# Altium schematic sheet Alimentacion.SchDoc
size A4; SheetNumber: 6; SheetTotal: 6
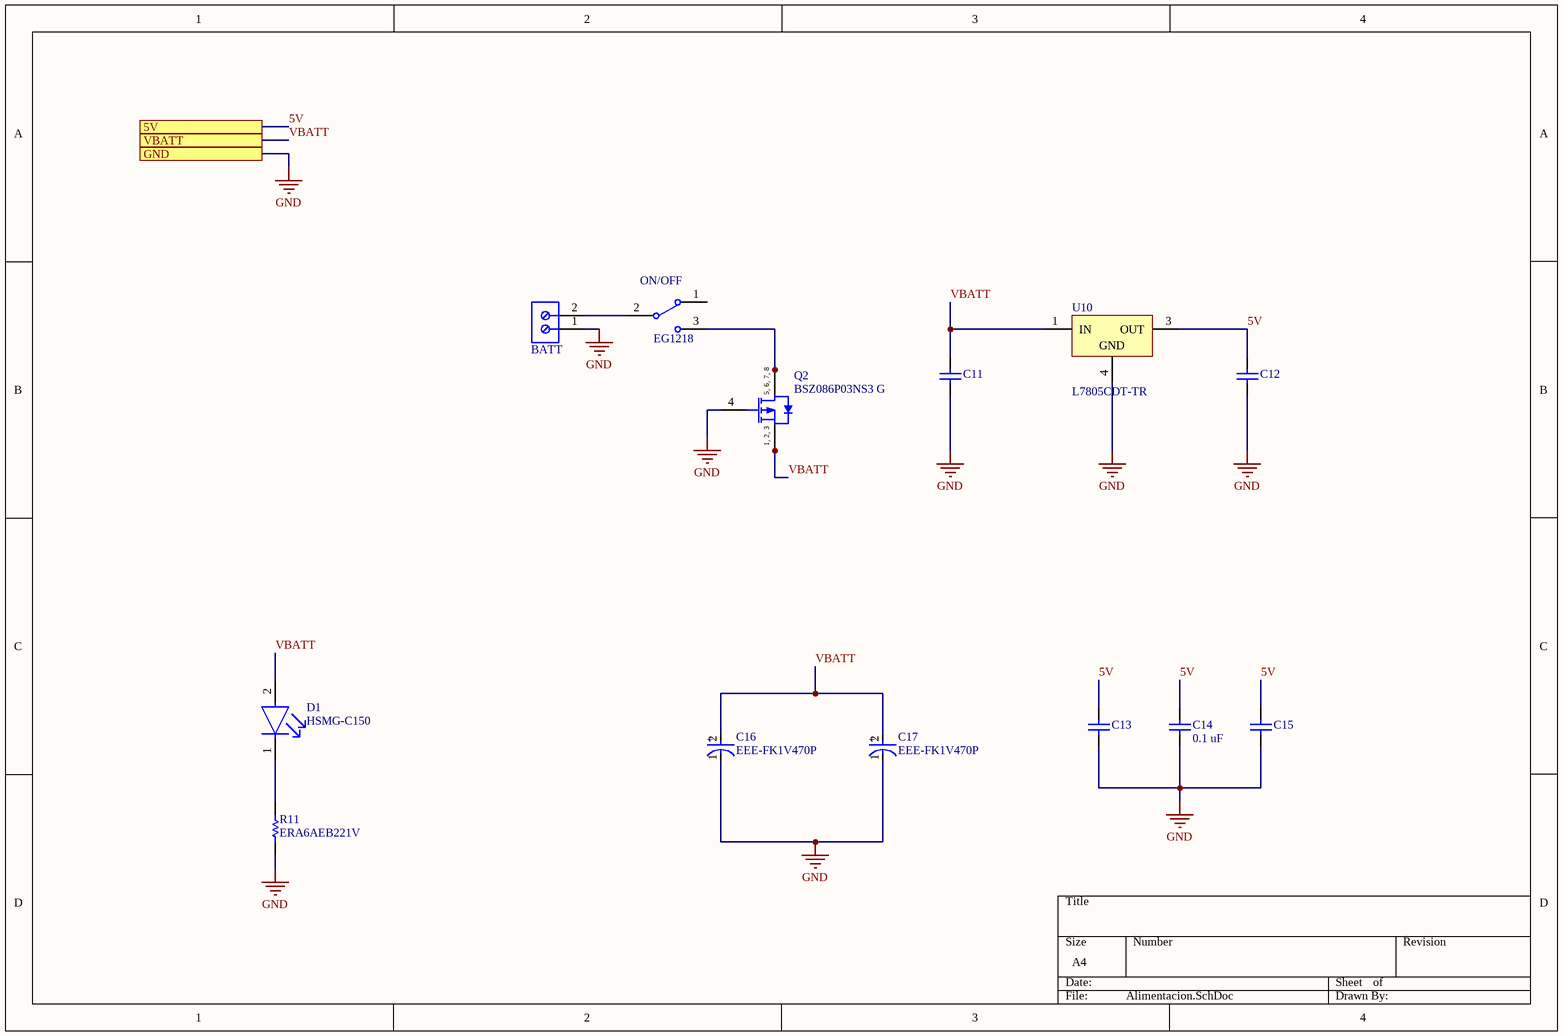
[diagram p0: Alimentacion.SchDoc]

## Parts
BATT  691214110002  [691214110002]  (value not drawn)
C11  C0805C106K4PACTU  [CAPC2013X140X50ML20T25]  (value not drawn)
C12  C0805C106K4PACTU  [CAPC2013X140X50ML20T25]  (value not drawn)
C13  C0805C106K4PACTU  [CAPC2013X140X50ML20T25]  (value not drawn)
C14  0.1 uF  [CAPC2013X94X50ML20T25]
C15  C0805C106K4PACTU  [CAPC2013X140X50ML20T25]  (value not drawn)
C16  EEE-FK1V470P  [FP-FK-D-MFG]
C17  EEE-FK1V470P  [FP-FK-D-MFG]
D1  HSMG-C150  [FP-HSMG-C150-MFG]
ON/OFF  EG1218  [ESWI-EG1218_V]
Q2  BSZ086P03NS3 G  [INF-PG-TSDSON-8-1_V]
R11  ERA6AEB221V  [RESC2013X60X40ML20T25]
U10  L7805CDT-TR  [TO-252_M]

## Ports
5V, GND, VBATT

## Nets
GND: BATT.1 C11.1 C12.1 C13.1 C14.1 C15.1 C16.1(C) C17.1(C) Q2.4(GATE) R11.1 U10.4(GND) ; port GND
5V: C12.2 C13.2 C14.2 C15.2 U10.3(OUT) ; port 5V
VBATT: C11.2 C16.2(A) C17.2(A) D1.2(A) Q2.1(SOURCE) Q2.2(SOURCE) Q2.3(SOURCE) U10.1(IN) ; port VBATT
NetBATT_2: BATT.2 ON/OFF.2(COM)
NetD1_1: D1.1(C) R11.2
NetON/OFF_3: ON/OFF.3 Q2.5(DRAIN) Q2.6(DRAIN) Q2.7(DRAIN) Q2.8(DRAIN)

Not connected (* = marked no-connect by the designer): ON/OFF 1

## Notes on the sheet
- (in symbol CMP-1099-00063-1) 5, 6, 7, 8; 1, 2, 3
- (in symbol CMP-05427-000002-1) +

## Library data of the parts
BATT = CMP-1502-02464-1: Serie 2141 - 3.50 mm Horizontal Entry Modular with Rising Cage Clamp WR-TBL, 2 pin; Manufacturer: Wurth Elektronik; Pin Number: 2; Pitch: 3.50mm; Datasheet URL: http://katalog.we-online.de/em/datasheet/6912141100xx.pdf; Packaging: Box; Mounting Technology: THT; Package Reference: 691214110002; Manufacturer URL: http://www.we-online.de; Part Number: 691214110002; Publisher: WurthElektronik; Operating Temperature: -40to105degC
C11-C13 C15 = CMP-2007-03242-1: 10µF ±10% 16V Ceramic Capacitor X5R 0805 (2012 Metric); Part Number: CL21A106KOQNNNG
C14 = CMP-2000-05016-1: Chip Capacitor, Ceramic, 0.1 uF, 10%, 50 V, 0805, RoHS, Tape and Reel; Manufacturer: AVX; Rated Voltage: 50V; Capacitance: 100nF; Dielectric: X7R; Case Size/Dimension: 0805; Tolerance (%): ±10%; Datasheet URL: http://www.farnell.com/datasheets/319609.pdf; Datasheet Version: Sep-07; Manufacturer URL: http://www.avx.com/
C16 C17 = CMP-05427-000002-1: CAP ALUM 47UF 20% 35V SMD; Manufacturer: Panasonic; Life: 2000Hours; Leakage Current: 16.45uA; Automotive Grade: Grade 2; Esr: 0.36Ω; Ripple Current: 240mA; Material: Aluminum; Dissipation Factor: 12%; Category: Cap; Device Class L3: Aluminum Electrolytic Capacitors; Value: 47uF; Device Class L2: Capacitors; ComponentLink2Description: Datasheet; Capacitance: 47uF; Temperature Range Low: -55°C; Device Class L1: Passive Components; Height: 6.1mm; Temperature Range High: +105°C; Lead Free: Yes; Octopart: https://octopart.com/eeefk1v470p-panasonic-4642848; Manufacturer Part Number: EEE-FK1V470P; Tolerance: 20%; Temperature: -55°C to +105°C; Voltage Rating: 35V; ComponentLink2URL: https://industrial.panasonic.com/cdbs/www-data/pdf/RDE0000/ABA0000C1181.pdf; Automotive: Yes; Mouser Description: Capacitor Aluminum Electrolytic 47uF 35 Volt 20% (6.3 X 5.8mm) Surface Mount 240mA 2000h 105C Automotive; RoHS: TRUE; Digikey Description: CAP ALUM 47UF 20% 35V SMD; Package: FK-D
D1 = CMP-2000-05061-2: LED GREEN DIFFUSED 1206 SMD; Manufacturer: Broadcom; Led Orientation: Top View; Max Junction Temp: +95°C; Peak Emmision Wavelength: 570nm; Viewing Angle: 170°; Wavelength: 572nm; Reverse Voltage: 5V; Luminous Intensity: 15mcd; Forward Voltage: 2.2V; Power Dissipation: 65mW; Forward Current: 20mA; ComponentLink2Description: Datasheet; Lead Free: Yes; Temperature Range Low: -40°C; Package: HSMG-C150; Digikey Description: LED GREEN DIFFUSED 1206 SMD; Mouser Description: LED Uni-Color Green 570nm 2-Pin Chip LED T/R; Manufacturer Part Number: HSMG-C150; Temperature Range High: +85°C; Device Class L1: Optoelectronics; Colour: Green; Category: Diode; Device Class L3: unset; RoHS: TRUE; Height: 1.2mm; ComponentLink2URL: https://docs.broadcom.com/docs/AV02-0551EN; Device Class L2: LEDs; Automotive: No; Ipc Land Pattern Name: DIOCP320160X55; Octopart: https://octopart.com/hsmg-c150-broadcom-71131304; Temperature: -40°C to +85°C
ON/OFF = CMP-1696-00002-1: Slide Switch, 500 V, -20 to 70 degC, 3-Pin THD, RoHS; Case\Package: SOT-23-5; Output Current: 150 mA; Nominal Output Voltage: 3.3 V; Max Power Dissipation: 250 mW; Min Input Voltage: 4.3 V; Outputs: 1; Max Input Voltage: 8 V; Dropout Voltage: 300 mV; PackageDescription: 3-Pin Through Hole Device, Body 11.6 x 4 mm, Pitch 2.5 mm; ComponentLink1URL: http://www.e-switch.ch/en/; RoHSCompliant: true; Length: 3 mm; ComponentLink1Description: Manufacturer URL; Power Rating: 250 mW; Mount: Surface Mount; Max Operating Temperature: 85 degC; REACH SVHC: No SVHC; Radiation Hardening: No; Height: 1.3 mm; Pins: 5; Max Ouput Current: 150 mA; Output Voltage: 3.3 V; Width: 1.8 mm; Package Quantity: 3000; ComponentLink2URL: https://www.e-switch.com/system/asset/product_line/data_sheet/119/EG.pdf; Min Operating Temperature: -40 degC; ComponentLink2Description: Datasheet; DatasheetVersion: Oct-15; PackageReference: EG1218; Packaging: Tape and Reel
Q2 = CMP-1099-00063-1: P-Channel OptiMOS P3 Power-Transistor, -30 V VDS, -40 A ID, -55 to 150 degC, PG-TSDSON-8-1, Reel, Green; Manufacturer: Infineon; RDS (on) (max): 8.6Â mOhm; Rth: 1.8Â K/W; QG: 43.2Â nC; VGS(th) (max): -1.9Â V; RthJC (max): 1.8 K/W; Green: TRUE; Pto t (max): 69Â W; ID (max): -40Â A; IDpuls (max): -160Â A; VDS (max): -30Â V; VGS(th) (min): -3.1Â V; ComponentLink1URL: http://www.infineon.com/; ComponentLink2URL: http://www.infineon.com/dgdl/BSZ086P03NS3+G_2.03.pdf?folderId=db3a304314dca38901154a7313d21a66&fileId=db3a30431ff9881501203d3a5e7d17a9; Mounting Technology: Surface Mount; PartNumber: BSZ086P03NS3 G; Packing: Reel; PackageVersion: Rev. 02, 09/2008; Halogen-free: TRUE; ComponentLink3URL: http://www.infineon.com/dgdl/BSZ240N12NS3+Rev2.0.pdf?folderId=db3a304313b8b5a60113cee8763b02d7&fileId=db3a30432a40a650012a42f3057a0038; PackageDescription: 8-Pin Plastic (Green) Thin Dual Small Outline Non-Leaded Package, 3.3 x 3.3 mm Body, 0.65 mm Pitch; PackageReference: PG-TSDSON-8-1; DatasheetVersion: Rev. 2.03; ComponentLink2Description: Datasheet; ComponentLink3Description: Package Specification; ComponentLink1Description: Manufacturer URL
R11 = CMP-2001-00612-1: Manufacturer: Panasonic; Part Number: ERA6AEB221V
U10 = CMP-0244-00216-1: Positive Voltage Regulator, 3-Pin DPAK, Tape and Reel; PackageVersion: 2011; PackageReference: TO-252; DatasheetVersion: 16/11/2011; PackageDescription: 3-Pin Transistor Outline Package 2.28 mm Pitch, 9.7 mm Lead Span (DPAK); ComponentLink1URL: http://www.st.com; ComponentLink2Description: Datasheet; ComponentLink1Description: Manufacturer URL; ComponentLink2URL: http://www.st.com/internet/com/TECHNICAL_RESOURCES/TECHNICAL_LITERATURE/DATASHEET/CD00000444.pdf